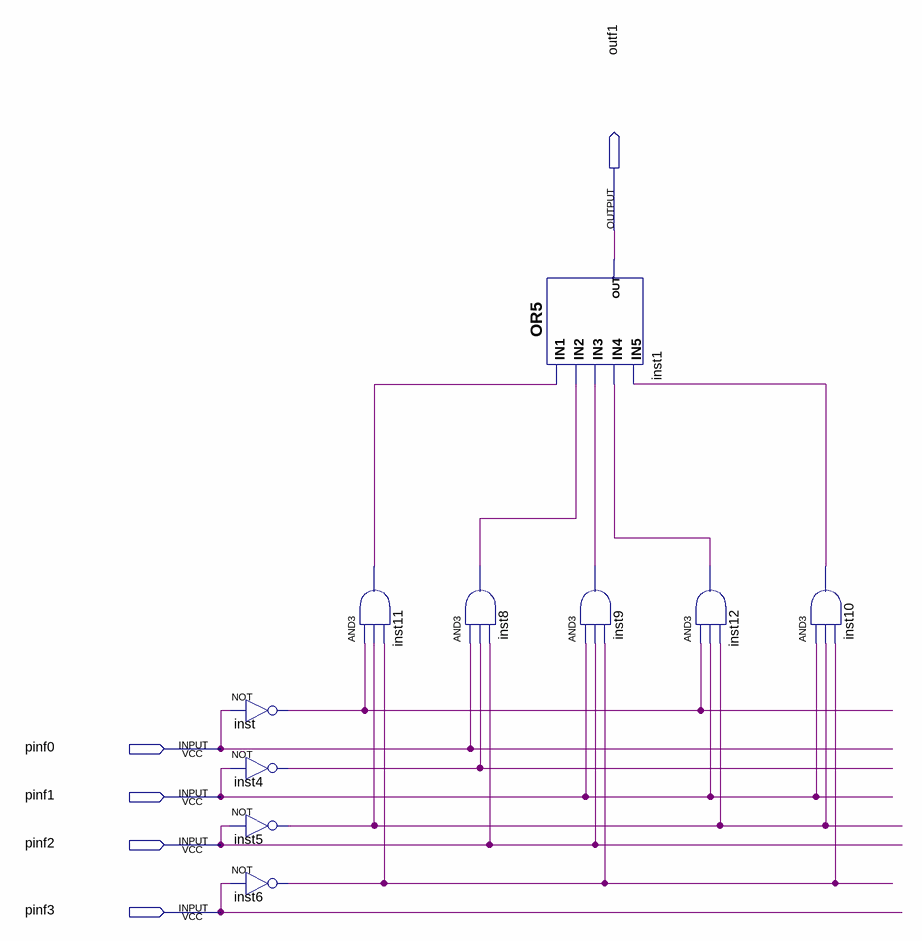
[diagram p0: schematic sheet]
// Quartus schematic OriginalF.bdf as structural Verilog: 10 symbols, 5 pins
module OriginalF (
  input  pinf0,
  input  pinf1,
  input  pinf2,
  input  pinf3,
  output outf1
);

  wire inst4_out, inst5_out, inst6_out, inst8_out, inst9_out, inst10_out, inst11_out, inst12_out, inst_out;

  not inst (inst_out, pinf0);
  not inst4 (inst4_out, pinf1);
  not inst5 (inst5_out, pinf2);
  not inst6 (inst6_out, pinf3);
  and inst11 (inst11_out, inst_out, inst5_out, inst6_out);
  and inst8 (inst8_out, pinf0, inst4_out, pinf2);
  or inst1 (outf1, inst11_out, inst8_out, inst9_out, inst12_out, inst10_out);
  and inst9 (inst9_out, pinf1, pinf2, inst6_out);
  and inst12 (inst12_out, inst_out, pinf1, inst5_out);
  and inst10 (inst10_out, pinf1, inst5_out, inst6_out);
endmodule
